# Altium schematic sheet OpenMPPT2-Control.SchDoc: =Project + Document
size A4; SheetNumber: 3; SheetTotal: SheetTotaal; Document: Control
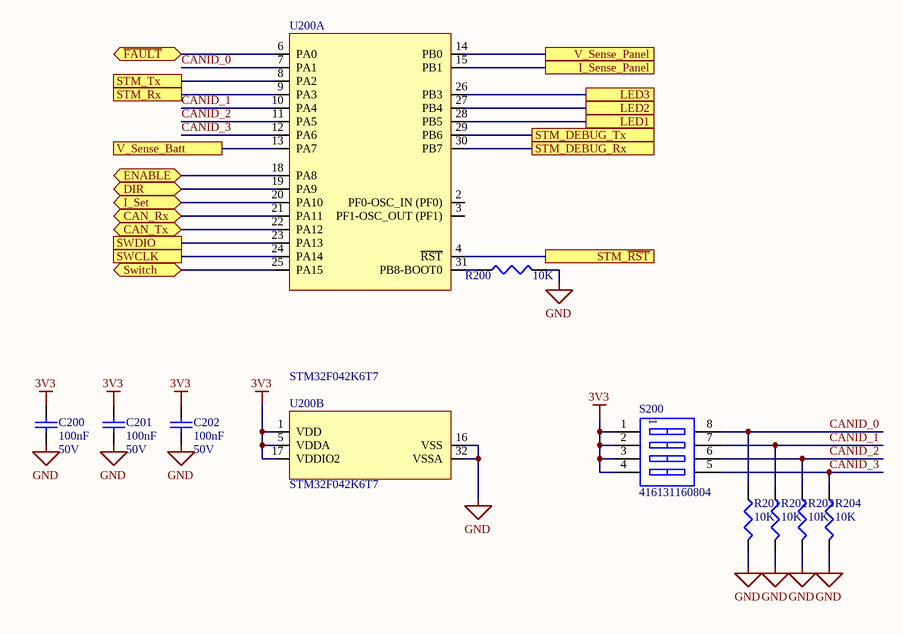
[diagram p0: OpenMPPT2-Control.SchDoc]

## Parts
C200  100nF  Voltage Rating: 50V  [C0603]
C201  100nF  Voltage Rating: 50V  [C0603]
C202  100nF  Voltage Rating: 50V  [C0603]
R200  10K  [0603]
R201  10K  [0603]
R202  10K  [0603]
R203  10K  [0603]
R204  10K  [0603]
S200  416131160804  [416131160804]
U200  STM32F042K6T7  [LQFP32]  (parts A,B of 2)

## Ports
CAN_Rx, CAN_Tx, DIR, ENABLE, I_Sense_Panel, I_Set, LED1, LED2, LED3, STM_DEBUG_Rx, STM_DEBUG_Tx, STM_Rx, STM_Tx, STM_~{RST}, SWCLK, SWDIO, Switch, V_Sense_Batt, V_Sense_Panel, ~{FAULT}

## Nets
3V3: C200.2 C201.2 C202.2 S200.1 S200.2 S200.3 S200.4 U200.1(VDD) U200.5(VDDA) U200.17(VDDIO2)
GND: C200.1 C201.1 C202.1 R200.2 R201.2 R202.2 R203.2 R204.2 U200.16(VSS) U200.32(VSSA)
CAN_Rx: U200.21(PA11) ; port CAN_Rx
CAN_Tx: U200.22(PA12) ; port CAN_Tx
CANID_0: R201.1 S200.8 U200.7(PA1)
CANID_1: R202.1 S200.7 U200.10(PA4)
CANID_2: R203.1 S200.6 U200.11(PA5)
CANID_3: R204.1 S200.5 U200.12(PA6)
DIR: U200.19(PA9) ; port DIR
ENABLE: U200.18(PA8) ; port ENABLE
~{FAULT}: U200.6(PA0) ; port ~{FAULT}
I_Sense_Panel: U200.15(PB1) ; port I_Sense_Panel
I_Set: U200.20(PA10) ; port I_Set
LED1: U200.28(PB5) ; port LED1
LED2: U200.27(PB4) ; port LED2
LED3: U200.26(PB3) ; port LED3
STM_DEBUG_Rx: U200.30(PB7) ; port STM_DEBUG_Rx
STM_DEBUG_Tx: U200.29(PB6) ; port STM_DEBUG_Tx
STM_~{RST}: U200.4(~{RST}) ; port STM_~{RST}
STM_Rx: U200.9(PA3) ; port STM_Rx
STM_Tx: U200.8(PA2) ; port STM_Tx
SWCLK: U200.24(PA14) ; port SWCLK
SWDIO: U200.23(PA13) ; port SWDIO
Switch: U200.25(PA15) ; port Switch
V_Sense_Batt: U200.13(PA7) ; port V_Sense_Batt
V_Sense_Panel: U200.14(PB0) ; port V_Sense_Panel
NetR200_1: R200.1 U200.31(PB8-BOOT0)

Not connected (* = marked no-connect by the designer): U200 2(PF0-OSC_IN_(PF0)) 3(PF1-OSC_OUT_(PF1))

## Notes on the sheet
- Title
- Size:
- Date:
- A4
- Designer:
- Time:
- Revision:
- Sheet
- of
- File:

## Library data of the parts
C200-C202 = 100nF/0603/CER/50V: Capacitor, 100nF, 50V, X7R; Capacitance Tolerance: ± 10%; Capacitor Case Style: 0603; Brand Number: MCCA000255; Brand: MULTICOMP; Dielectric Characteristic: X7R; Capacitance: 100nF; Temperature Range: -55°C to +125°C; Price: 0,008; Order Code Supplier: 1759122RL; Supplier: Farnell
R200-R204 = 10K/0603/0063W/50V: Resistor, 10K, 1%, 0.063W, 50V, 100PPM, 0603; Brand: MULTICOMP; Brand Number: MC0063W0603110K; Case Style: 0603; Order Code Supplier: 1469748; Power Rating: 0.063W; Price: 0,038; Resistance: 10K; Supplier: Farnell; Temperature Coefficient: ± 100PPM; Temperature Range: -55°C to +125°C; Voltage Rating: 50V
S200 = 416131160804: 1.27 mm small compact SMD flat actuator with top tape WS-DISV; Pole Number: 4; ComponentLink1Description: Manufacturer; ComponentLink1URL: http://www.we-online.de; ComponentLink2Description: Datasheet; ComponentLink2URL: http://katalog.we-online.de/em/datasheet/4161311608xx.pdf; Part Number: 416131160804; Published Date: March 2017; Publisher: Wurth Elektronik
U200 = STM32F042K6T7: 32 Bit Microcontroller, USB Line, ARM Cortex-M0, 48 MHz, 128 KB, 16 KB, 48, LQFP; Brand: STMICROELECTRONICS; Order Code Supplier: 2469553; Supplier: Farnell; Brand Number: STM32F042K6T7; Price: 1.46